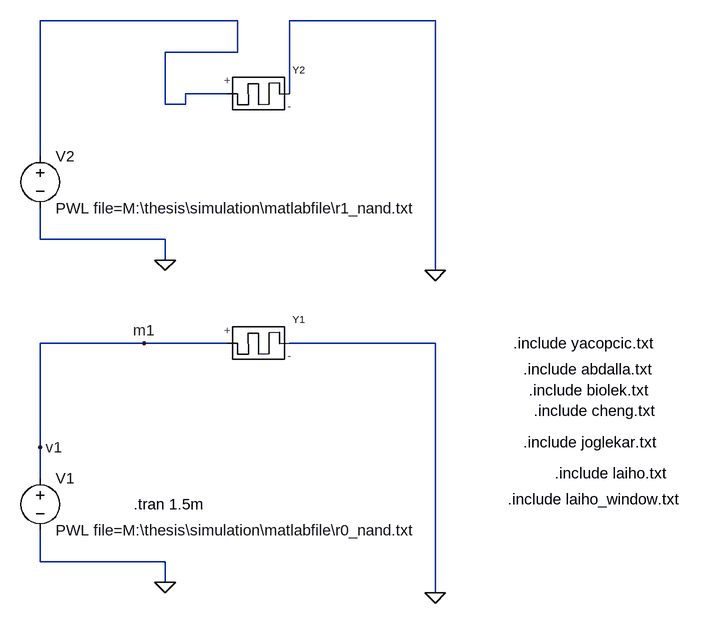
[diagram p0: schematic memmodel_sim.asc]
memmodel_sim.asc, the LTspice schematic file:
Version 4
SHEET 1 908 680
WIRE 160 -464 -144 -464
WIRE 464 -464 240 -464
WIRE 160 -416 160 -464
WIRE 160 -416 48 -416
WIRE 144 -352 80 -352
WIRE 240 -352 240 -464
WIRE 48 -336 48 -416
WIRE 80 -336 80 -352
WIRE 80 -336 48 -336
WIRE -144 -256 -144 -464
WIRE -144 -128 -144 -176
WIRE 48 -128 -144 -128
WIRE 48 -96 48 -128
WIRE 464 -80 464 -464
WIRE 16 32 -144 32
WIRE 144 32 16 32
WIRE 464 32 240 32
WIRE -144 192 -144 32
WIRE -144 240 -144 192
WIRE -144 368 -144 320
WIRE 48 368 -144 368
WIRE 48 400 48 368
WIRE 464 416 464 32
FLAG 48 400 0
FLAG 464 416 0
FLAG -144 192 v1
FLAG 16 32 m1
FLAG 48 -96 0
FLAG 464 -80 0
SYMBOL voltage -144 224 R0
WINDOW 123 24 124 Left 2
WINDOW 39 0 0 Left 2
SYMATTR InstName V1
SYMATTR Value PWL file=M:\thesis\simulation\matlabfile\r0_nand.txt
SYMBOL memristormodel 224 32 R0
SYMATTR InstName Y1
SYMATTR Value MEM_YAKOPCIC
SYMATTR SpiceModel M2
SYMBOL voltage -144 -272 R0
WINDOW 123 24 124 Left 2
WINDOW 39 0 0 Left 2
SYMATTR InstName V2
SYMATTR Value PWL file=M:\thesis\simulation\matlabfile\r1_nand.txt
SYMBOL memristormodel 224 -352 R0
SYMATTR InstName Y2
SYMATTR Value MEM_YAKOPCIC
SYMATTR SpiceModel M1
TEXT 0 280 Left 2 !.tran 1.5m
TEXT 584 32 Left 2 !.include yacopcic.txt
TEXT 600 72 Left 2 !.include abdalla.txt
TEXT 608 104 Left 2 !.include biolek.txt
TEXT 616 136 Left 2 !.include cheng.txt
TEXT 600 184 Left 2 !.include joglekar.txt
TEXT 648 232 Left 2 !.include laiho.txt
TEXT 576 272 Left 2 !.include laiho_window.txt

The netlist it stands for:
* memmodel_sim.asc
V1 m1 0 PWL file=M:\thesis\simulation\matlabfile\r0_nand.txt
XY1 m1 0 M2 MEM_YAKOPCIC  ; pins + -
V2 N001 0 PWL file=M:\thesis\simulation\matlabfile\r1_nand.txt
XY2 N001 0 M1 MEM_YAKOPCIC  ; pins + -
.tran 1.5m
.include yacopcic.txt
.include abdalla.txt
.include biolek.txt
.include cheng.txt
.include joglekar.txt
.include laiho.txt
.include laiho_window.txt
.backanno
.end